# Altium schematic sheet Gate_Protection.SchDoc
size A; SheetNumber: 9; SheetTotal: 9
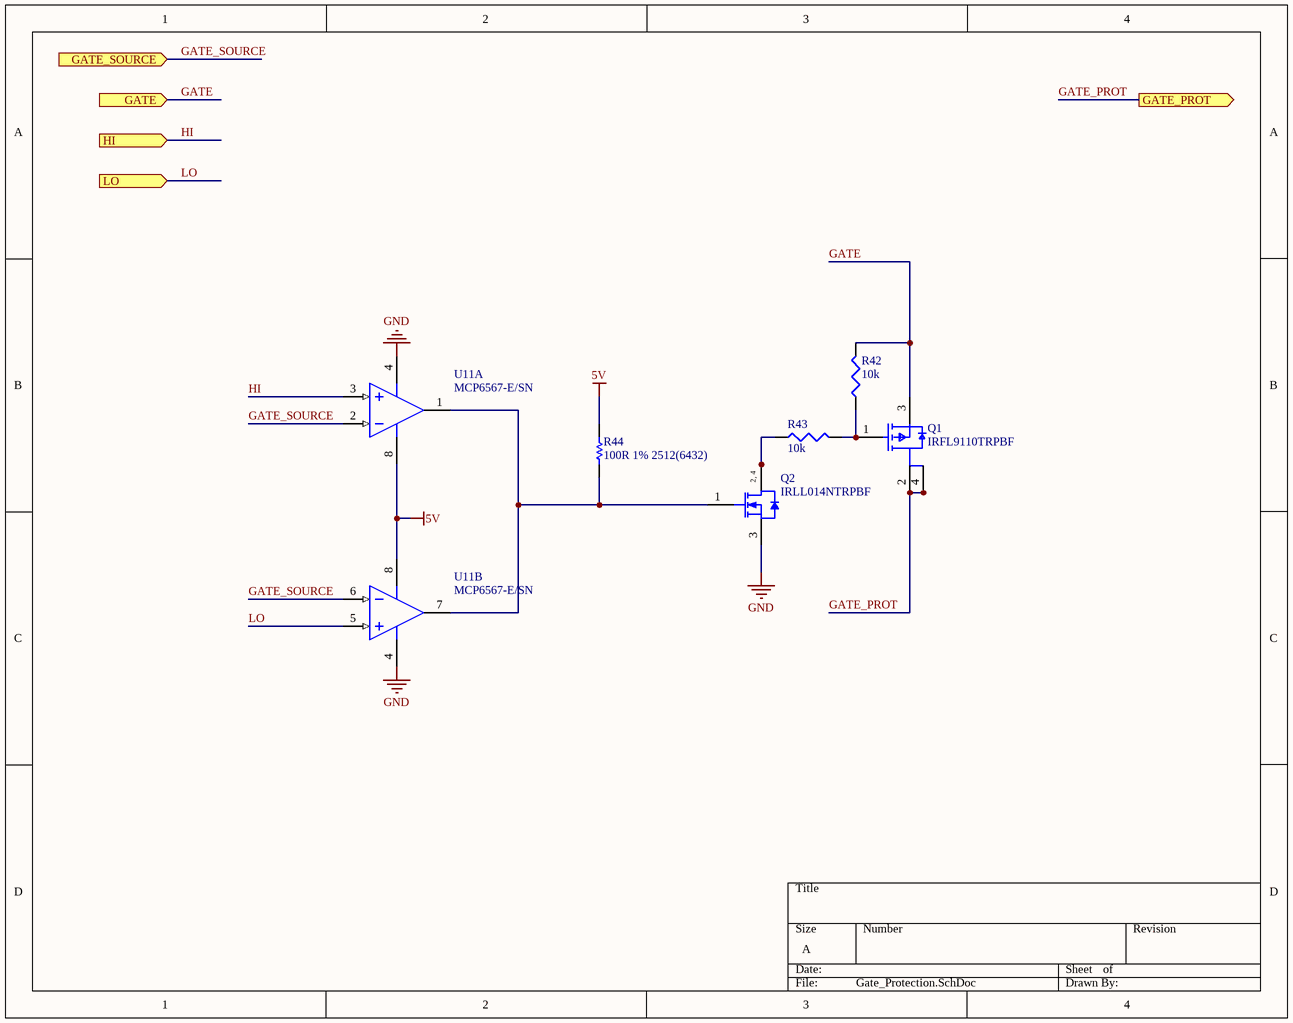
[diagram p0: Gate_Protection.SchDoc]

## Parts
Q1  IRFL9110TRPBF  [FP-S-82109-IPC_C]
Q2  IRLL014NTRPBF  [ONSC-SOT-223-4-318E-04_V]
R42  10k  [J1-0603]
R43  10k  [J1-0603]
R44  100R 1% 2512(6432)  [RESC2512(6432)_N]
U11  MCP6567-E/SN  [SOIC-SN8_L]  (parts A,B of 2)

## Ports
GATE (in), GATE_PROT (out), GATE_SOURCE (in), HI (in), LO (in)

## Nets
5V: R44.2 U11.8(VDD)
GND: Q2.3(S) U11.4(VSS)
GATE: Q1.3(S) R42.2 ; port GATE
GATE_PROT: Q1.2(D) Q1.4(D) ; port GATE_PROT
GATE_SOURCE: U11.2(INA-) U11.6(INB-) ; port GATE_SOURCE
HI: U11.3(INA+) ; port HI
LO: U11.5(INB+) ; port LO
NetQ1_1: Q1.1(G) R42.1 R43.2
NetQ2_1: Q2.1(G) R44.1 U11.1(OUTA) U11.7(OUTB)
NetQ2_2: Q2.2(D) Q2.4(D) R43.1

## Notes on the sheet
- (in symbol CMP-1058-00724-1) 2, 4

## Library data of the parts
Q1 = CMP-2000-06474-2: MOSFET P-CH 100V 1.1A SOT223; Manufacturer: Vishay; Input Capacitace At Vds: 200pF @ -25V; Reverse Recovery Charge: 150nC; Max Forward Diode Voltage: -5.5V; Gate To Source Voltage: 20V; Gate Charge At Vgs: 8.7nC @ -10V; Drain To Source Voltage: -100V; Number Of Channels: 1; Reverse Recovery Time: 80ns; Turn On Delay Time: 10ns; Threshold Vgs Max: -4V; Drain To Source Resistance: 1.2Ω; Continuous Drain Current: -1.1A; Rthja Max: 60°C/W; Standoff Height: 0.061mm; Depletion Mode: False; Max Junction Temp: +150°C; Power Dissipation: 2W; Pulse Drain Current: -8.8A; Threshold Vgs Min: -2V; Turn Off Delay Time: 15ns; Package: S-82109; Device Class L3: MOSFETs; ComponentLink2Description: Datasheet; Drain To Source Breakdown Voltage: -100V; Number Of P Channels: 1; Temperature: -55°C to +150°C; Device Class L1: Discrete Semiconductors; Manufacturer Part Number: IRFL9110TRPBF; ComponentLink2URL: http://www.vishay.com/docs/91196/sihfl911.pdf; Temperature Range Low: -55°C; Ipc Land Pattern Name: SOT230P700X168-4; Digikey Description: MOSFET P-CH 100V 1.1A SOT223; Automotive: No; Mouser Description: MOSFET P-Chan 100V 1.1 Amp; Temperature Range High: +150°C; Category: Trans; Height: 1.8mm; Lead Free: Yes; Octopart: https://octopart.com/irfl9110trpbf-vishay-39554730; Device Class L2: Transistors; RoHS: TRUE
Q2 = CMP-1058-00724-1: Mosfet, Power; N-ch; Vdss 55V; Rds(on) 0.14 Ohm; Id 2.8A; SOT-223; Pd 2.1W; Vgs +/-16V; PartNumber: NVF3055L108T1G; Manufacturer: On Semiconductor; Coss Typ (pF): 112; VGS(th) Max (V): 2; Channel Polarity: N Channel; Packing: Tape and Reel; Crss Typ (pF): 40; Ciss Typ (pF): 313; Qrr Typ (nC): 44; Configuration: Single; V(BR)DSS Min (V): 60; ComponentLink3Description: Package Specification; Package Type: SOT-223-4 / TO-261-4; PackageReference: SOT-223-4-318E-04; ComponentLink2URL: http://www.onsemi.com/pub_link/Collateral/NTF3055L108-D.PDF; Mounting Technology: Surface Mount; RoHS: Pb-Free; PackageVersion: Rev. N, 08/2009; ComponentLink3URL: http://www.onsemi.com/pub_link/Collateral/318E-04.PDF; ComponentLink1Description: Manufacturer URL; ComponentLink2Description: Datasheet; DatasheetVersion: Rev. 6; PackageDescription: 4-Pin Small Outline Transistor, Body 6.5 x 3.5 mm, Pitch 2.3 mm; ComponentLink1URL: http://www.onsemi.com/
R42 R43 = Res3: Resistor; Published: 8-Jun-2000; LatestRevisionDate: 29-May-2009; LatestRevisionNote: IPC-7351 Footprint Added.; PackageReference: J1-0603; Publisher: Altium Limited; PackageDescription: Chip Resistor
R44 = CMP-1018-00397-1: 100R 1W 1% 2512 (6432 Metric)  SMD; Case-EIA: 2512; Value: 100.00 Ohm; Case-Metric: 6432; Power: 1 W; Technology: SMT; Tolerance: 1 %
U11 = CMP-0187-00215-3: None; Natural Thermal Resistance: 163°C/W; Min Supply Voltage: 1.8V; Power Supply Rejection Ratio (PSRR): 70dB; Common Mode Rejection Ratio: 66dB; Input Bias Current: 1pA; Max Supply Voltage: 5.5V; Output Current: 50mA; Number of Channels: 2; Input Offset Voltage (Vos): 10mV; Propagation Delay: 80ns; Operating Supply Voltage: 5V; Response Time: 56ns; Nominal Supply Current: 100uA; Hysteresis: 5mV; Quiescent Current: 130uA; Length: 4.9mm; Case/Package: SOIC; Width: 3.9mm; Packaging: Rail/Tube; REACH SVHC: No SVHC; Min Operating Temperature: -40°C; Radiation Hardening: No; Type: General Purpose; Package Quantity: 100; Technology: CMOS; Height: 1.25mm; Number of Elements: 2; Lead Free: Lead Free; RoHS Compliant: Yes; Max Input Current: 1pA; Max Operating Temperature: 125°C; Number of Pins: 8; Mount: Surface Mount